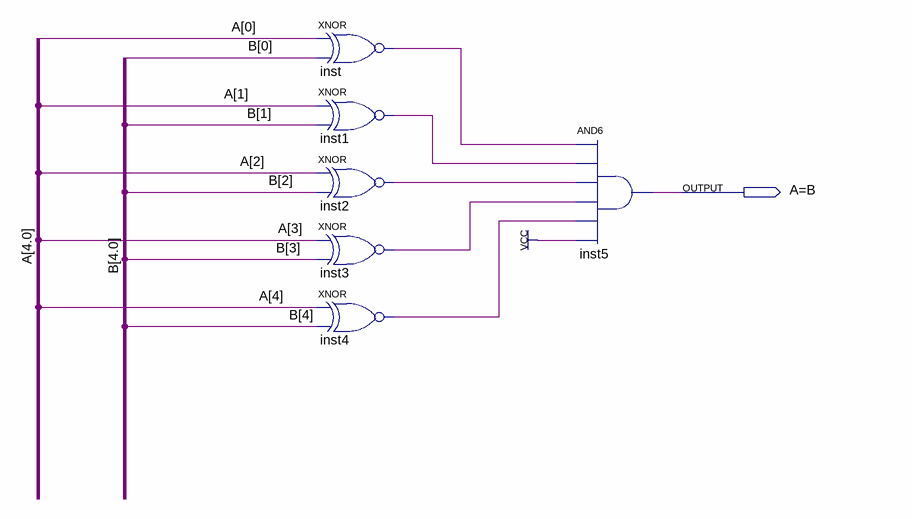
[diagram p0: schematic sheet]
// Quartus schematic eos_A=B.bdf as structural Verilog: 6 symbols, 1 pins
module \eos_A=B  (
  output \A=B 
);

  wire inst1_out, inst2_out, inst3_out, inst4_out, inst_out;
  wire [4:0] A, B;

  xnor inst (inst_out, A[0], B[0]);
  xnor inst1 (inst1_out, A[1], B[1]);
  xnor inst2 (inst2_out, A[2], B[2]);
  xnor inst3 (inst3_out, A[3], B[3]);
  xnor inst4 (inst4_out, A[4], B[4]);
  and inst5 (\A=B , inst_out, inst1_out, inst2_out, inst3_out, inst4_out, 1'b1);
endmodule
